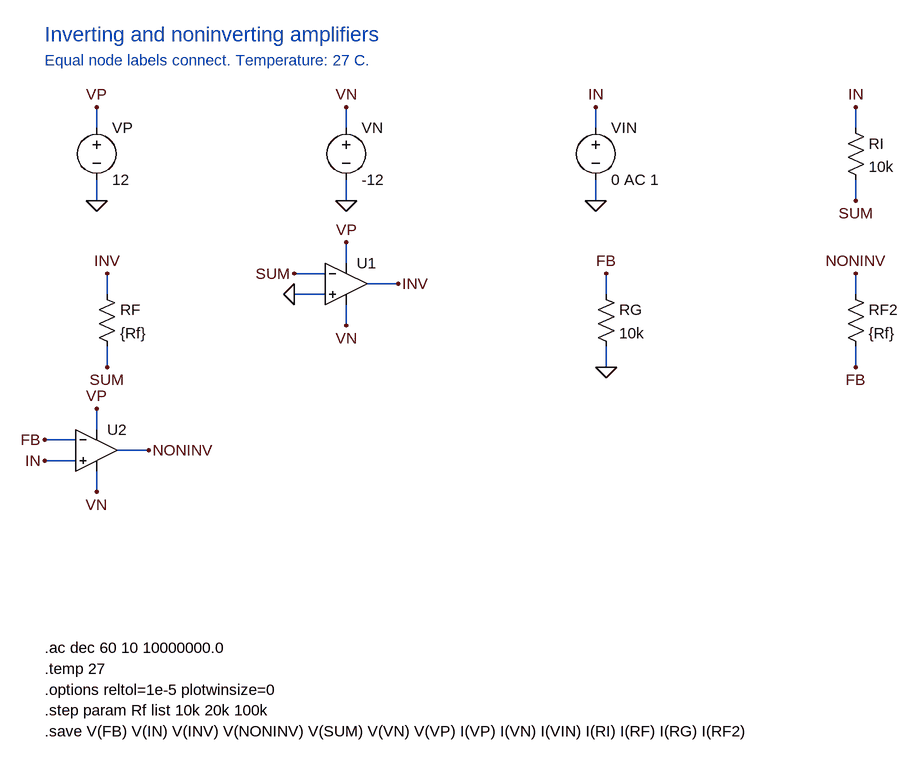
[diagram p0: schematic opamp-gain-configurations.asc]
opamp-gain-configurations.asc, the LTspice schematic file:
Version 4
SHEET 1 1740 1256
WIRE 144 176 144 144
WIRE 144 256 144 288
WIRE 528 176 528 144
WIRE 528 256 528 288
WIRE 912 176 912 144
WIRE 912 256 912 288
WIRE 1312 176 1312 144
WIRE 1312 256 1312 288
WIRE 160 432 160 400
WIRE 160 512 160 544
WIRE 496 432 448 432
WIRE 496 400 448 400
WIRE 528 384 528 352
WIRE 528 448 528 480
WIRE 560 416 608 416
WIRE 928 432 928 400
WIRE 928 512 928 544
WIRE 1312 432 1312 400
WIRE 1312 512 1312 544
WIRE 112 688 64 688
WIRE 112 656 64 656
WIRE 144 640 144 608
WIRE 144 704 144 736
WIRE 176 672 224 672
FLAG 144 144 VP
FLAG 144 288 0
FLAG 528 144 VN
FLAG 528 288 0
FLAG 912 144 IN
FLAG 912 288 0
FLAG 1312 144 IN
FLAG 1312 288 SUM
FLAG 160 400 INV
FLAG 160 544 SUM
FLAG 448 432 0
FLAG 448 400 SUM
FLAG 528 352 VP
FLAG 528 480 VN
FLAG 608 416 INV
FLAG 928 400 FB
FLAG 928 544 0
FLAG 1312 400 NONINV
FLAG 1312 544 FB
FLAG 64 688 IN
FLAG 64 656 FB
FLAG 144 608 VP
FLAG 144 736 VN
FLAG 224 672 NONINV
SYMBOL voltage 144 160 R0
SYMATTR InstName VP
SYMATTR Value 12
SYMBOL voltage 528 160 R0
SYMATTR InstName VN
SYMATTR Value -12
SYMBOL voltage 912 160 R0
SYMATTR InstName VIN
SYMATTR Value 0 AC 1
SYMBOL res 1296 160 R0
SYMATTR InstName RI
SYMATTR Value 10k
SYMBOL res 144 416 R0
SYMATTR InstName RF
SYMATTR Value {Rf}
SYMBOL OpAmps/UniversalOpamp2 528 416 R0
SYMATTR InstName U1
SYMATTR SpiceModel level2
SYMATTR Value2 Avol=1Meg GBW=10Meg Slew=10Meg
SYMATTR SpiceLine Ilimit=100m Rail=0.5 Vos=0
SYMATTR SpiceLine2 En=0 Enk=0 In=0 Ink=0 Rin=1G
SYMBOL res 912 416 R0
SYMATTR InstName RG
SYMATTR Value 10k
SYMBOL res 1296 416 R0
SYMATTR InstName RF2
SYMATTR Value {Rf}
SYMBOL OpAmps/UniversalOpamp2 144 672 R0
SYMATTR InstName U2
SYMATTR SpiceModel level2
SYMATTR Value2 Avol=1Meg GBW=10Meg Slew=10Meg
SYMATTR SpiceLine Ilimit=100m Rail=0.5 Vos=0
SYMATTR SpiceLine2 En=0 Enk=0 In=0 Ink=0 Rin=1G
TEXT 64 32 Left 3 ;Inverting and noninverting amplifiers
TEXT 64 72 Left 2 ;Equal node labels connect. Temperature: 27 C.
TEXT 64 976 Left 2 !.ac dec 60 10 10000000.0
TEXT 64 1008 Left 2 !.temp 27
TEXT 64 1040 Left 2 !.options reltol=1e-5 plotwinsize=0
TEXT 64 1072 Left 2 !.step param Rf list 10k 20k 100k
TEXT 64 1104 Left 2 !.save V(FB) V(IN) V(INV) V(NONINV) V(SUM) V(VN) V(VP) I(VP) I(VN) I(VIN) I(RI) I(RF) I(RG) I(RF2)

The netlist it stands for:
* opamp-gain-configurations.asc
VP VP 0 12
VN VN 0 -12
VIN IN 0 0 AC 1
RI IN SUM 10k
RF INV SUM {Rf}
XU1 0 SUM VP VN INV level2 Avol=1Meg GBW=10Meg Slew=10Meg Ilimit=100m Rail=0.5 Vos=0 En=0 Enk=0 In=0 Ink=0 Rin=1G  ; pins In+ In- V+ V- OUT
RG FB 0 10k
RF2 NONINV FB {Rf}
XU2 IN FB VP VN NONINV level2 Avol=1Meg GBW=10Meg Slew=10Meg Ilimit=100m Rail=0.5 Vos=0 En=0 Enk=0 In=0 Ink=0 Rin=1G  ; pins In+ In- V+ V- OUT
* Inverting and noninverting amplifiers
* Equal node labels connect. Temperature: 27 C.
.ac dec 60 10 10000000.0
.temp 27
.options reltol=1e-5 plotwinsize=0
.step param Rf list 10k 20k 100k
.save V(FB) V(IN) V(INV) V(NONINV) V(SUM) V(VN) V(VP) I(VP) I(VN) I(VIN) I(RI) I(RF) I(RG) I(RF2)
.lib UniversalOpAmp2.lib
.backanno
.end